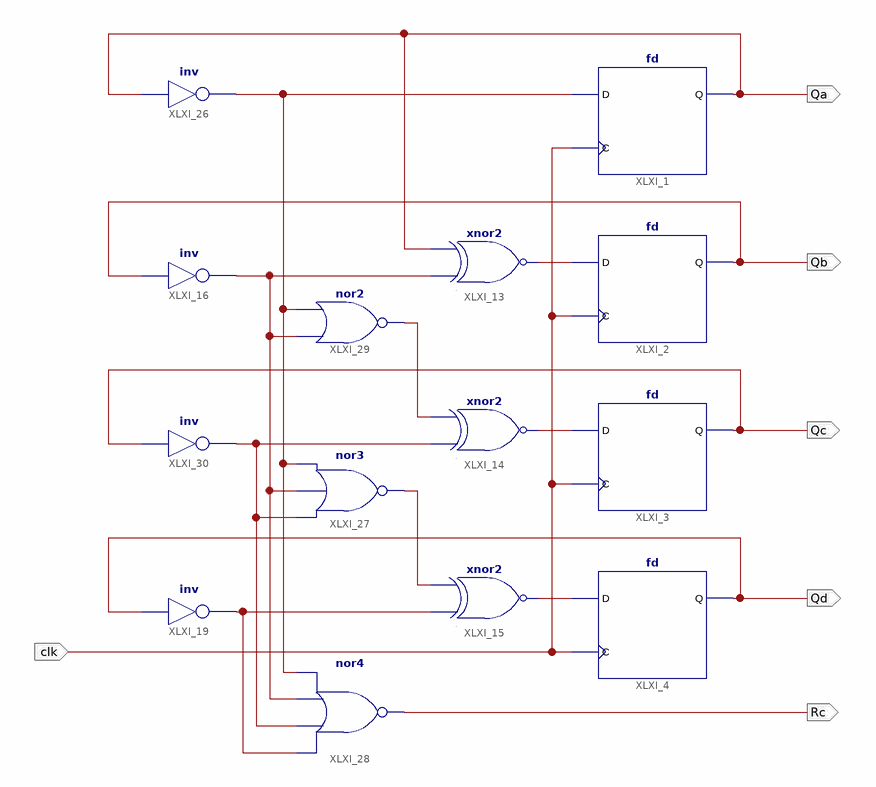
[diagram p0: schematic sheet 1]
// Xilinx ISE schematic Counter4b.sch (kintex7) as structural Verilog: 14 symbols, 6 ports
module Counter4b (
  input  clk,
  output Qa,
  output Qb,
  output Qc,
  output Qd,
  output Rc
);

  wire nQa, nQb, nQc, nQd, XLXN_12, XLXN_13, XLXN_14, XLXN_35, XLXN_36;

  fd XLXI_1 (.C(clk), .D(nQa), .Q(Qa));
  fd XLXI_4 (.C(clk), .D(XLXN_12), .Q(Qd));
  xnor XLXI_13 (XLXN_14, nQb, Qa);
  xnor XLXI_14 (XLXN_13, nQc, XLXN_35);
  xnor XLXI_15 (XLXN_12, nQd, XLXN_36);
  not XLXI_16 (nQb, Qb);
  not XLXI_19 (nQd, Qd);
  not XLXI_26 (nQa, Qa);
  fd XLXI_2 (.C(clk), .D(XLXN_14), .Q(Qb));
  fd XLXI_3 (.C(clk), .D(XLXN_13), .Q(Qc));
  nor XLXI_29 (XLXN_35, nQb, nQa);
  nor XLXI_27 (XLXN_36, nQc, nQb, nQa);
  nor XLXI_28 (Rc, nQd, nQc, nQb, nQa);
  not XLXI_30 (nQc, Qc);
endmodule
